# EAGLE schematic servo controller (EAGLE 7.2.0)
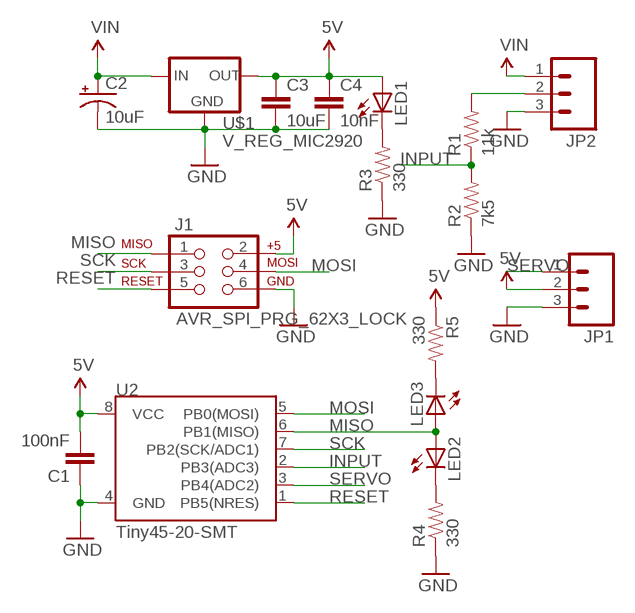
[diagram p0: schematic, sheet 1]

## Parts
C1  100nF  CAP0603-CAP  [0603-CAP]
C2  10uF  CPOL-USB  [PANASONIC_B]
C3  10uF  CAP0603-CAP  [0603-CAP]
C4  10nF  CAP0603-CAP  [0603-CAP]
J1  AVR_SPI_PRG_62X3_LOCK  [2X3_LOCK]
JP1  M03LOCK  [1X03_LOCK]
JP2  M03POLAR_LOCK  [MOLEX-1X3_LOCK]
LED1  LED0603  [LED-0603]
LED2  LED0603  [LED-0603]
LED3  LED0603  [LED-0603]
R1  11k  RESISTOR0603  [0603-RES]
R2  7k5  RESISTOR0603  [0603-RES]
R3  330  RESISTOR0603  [0603-RES]
R4  330  RESISTOR0603  [0603-RES]
R5  330  RESISTOR0603  [0603-RES]
U2  Tiny45-20-SMT  ATTINY45TINY45-20-SMT  [SO08-EIAJ]
U$1  V_REG_MIC2920  [SOT223]

## Nets
5V: C1.2 C3.1 C4.1 J1.2 JP1.2 LED1.A R5.1 U2.8(VCC) U$1.3(OUT)
GND: C1.1 C2.- C3.2 C4.2 J1.6 JP1.3 JP2.3 R2.1 R3.1 R4.1 U2.4(GND) U$1.2(GND)
INPUT: R1.1 R2.2 U2.2(PB3(ADC3))
MISO: J1.1 LED2.A LED3.A U2.6(PB1(MISO))
MOSI: J1.4 U2.5(PB0(MOSI))
N$1: JP2.2 R1.2
N$2: LED1.C R3.2
N$3: LED2.C R4.2
N$4: LED3.C R5.2
RESET: J1.5 U2.1(PB5(NRES))
SCK: J1.3 U2.7(PB2(SCK/ADC1))
SERVO: JP1.1 U2.3(PB4(ADC2))
VIN: C2.+ JP2.1 U$1.1(IN)

## Library data of the parts
C1 C3 C4 = SparkFun-Capacitors:CAP: Capacitor Standard 0603 ceramic capacitor, and 0.1" leaded capacitor.
C2 = rcl:CPOL-US: POLARIZED CAPACITOR, American symbol
J1 = SparkFun-Connectors:AVR_SPI_PRG_6: AVR ISP 6 Pin This is the reduced ISP connector for AVR programming. Common on Arduino. This footprint will take up less PCB space and can be used with a 10-pin to 6-pin adapter such as SKU: BOB-08508
JP1 JP2 = SparkFun-Connectors:M03: Header 3 Standard 3-pin 0.1" header. Use with straight break away headers (SKU : PRT-00116), right angle break away headers (PRT-00553), swiss pins (PRT-00743), machine pins (PRT-00117), and female headers (PRT-00115). Molex polarized connector foot print use with SKU : PRT-08232 with associated crimp pins and housings.
LED1-LED3 = SparkFun-LED:LED: LEDs Standard schematic elements and footprints for 5mm, 3mm, 1206, and 0603 sized LEDs. 5mm - Spark Fun Electronics SKU : COM-00529 (and others)
R1-R5 = SparkFun-Resistors:RESISTOR: Resistor Basic schematic elements and footprints for 0603, 1206, and PTH resistors.
U2 = SparkFun-DigitalIC:ATTINY45: Atmel 8-pin 2/4/8kB flash uC; PROD_ID: IC-08922
U$1 = SparkFun-PowerIC:V_REG_MIC2920: MIC2920A (http://www.micrel.com/_PDF/mic2920.pdf) - 400mA output LDO Regulator